# Altium schematic sheet czujnik_dotyku.SchDoc: Touch sensor
size A4
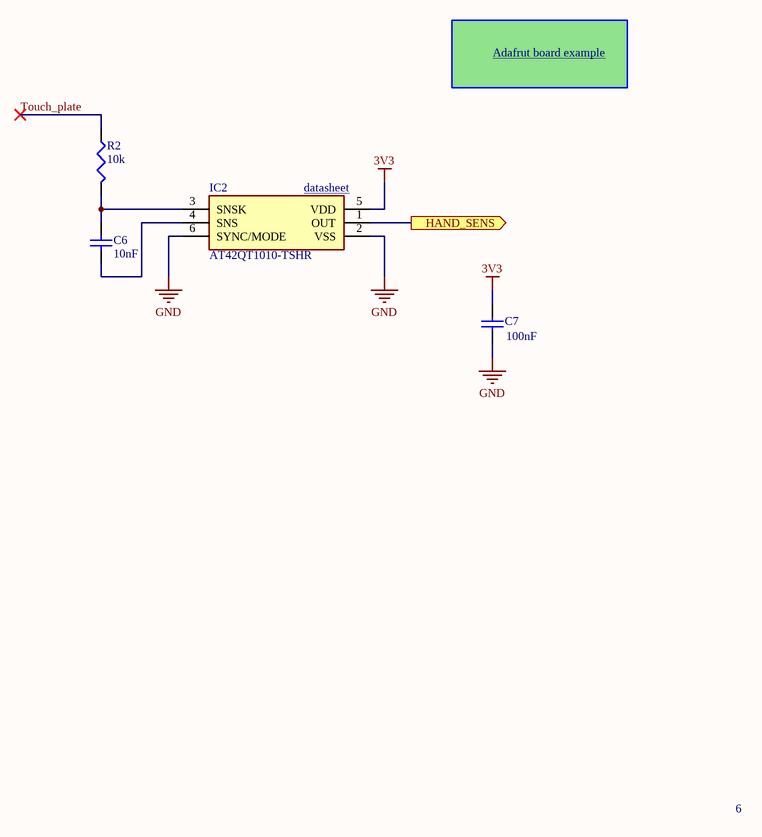
[diagram p0: czujnik_dotyku.SchDoc]

## Parts
C6  value 10nF  [C0805]  (hidden comment: Cap)
C7  value 100nF  [C0805]  (hidden comment: Cap)
IC2  AT42QT1010-TSHR  [SOT95P280X145-6N]
R2  value 10k  [R0603]  (hidden comment: Res3)

## Ports
HAND_SENS (out)

## Nets
3V3: C7.2 IC2.5(VDD)
GND: C7.1 IC2.2(VSS) IC2.6(SYNC/MODE)
HAND_SENS: IC2.1(OUT) ; port HAND_SENS
Touch_plate: R2.2
NetC6_1: C6.1 IC2.4(SNS)
NetC6_2: C6.2 IC2.3(SNSK) R2.1

## Notes on the sheet
- Adafrut board example <https://learn.adafruit.com/adafruit-capacitive-touch-sensor-breakouts/downloads>
- (near IC2) datasheet <https://cdn-shop.adafruit.com/datasheets/AT42QT1010.pdf>
- 6

## Library data of the parts
C6 C7 = Cap: Capacitor; Published: 8-Jun-2000; LatestRevisionDate: 17-Jul-2002; LatestRevisionNote: Re-released for DXP Platform.; PackageReference: RAD-0.3; Publisher: Altium Limited; PackageDescription: Radial Cap, Thru-Hole; 2 Leads; 0.3 in Pin Spacing
IC2 = AT42QT1010-TSHR: capacitive touch sensor; Manufacturer_Name: Microchip; Datasheet Link: http://www.atmel.com/images/atmel-9541-at42-qtouch-bsw-at42qt1010_datasheet.pdf; Height: 1.45mm; Manufacturer_Part_Number: AT42QT1010-TSHR; Arrow Part Number: AT42QT1010-TSHR; Arrow Price/Stock: https://www.arrow.com/en/products/at42qt1010-tshr/microchip-technology; Mouser Part Number: 556-AT42QT1010-TSHR; Mouser Price/Stock: https://www.mouser.co.uk/ProductDetail/Microchip-Technology/AT42QT1010-TSHR?qs=xbJoyvfFV%2F%252BFK88JVR2efg%3D%3D
R2 = Res3: Resistor; Published: 8-Jun-2000; LatestRevisionDate: 29-May-2009; LatestRevisionNote: IPC-7351 Footprint Added.; PackageReference: J1-0603; Publisher: Altium Limited; PackageDescription: Chip Resistor